# EAGLE schematic Analog-System (EAGLE 8.5.2)
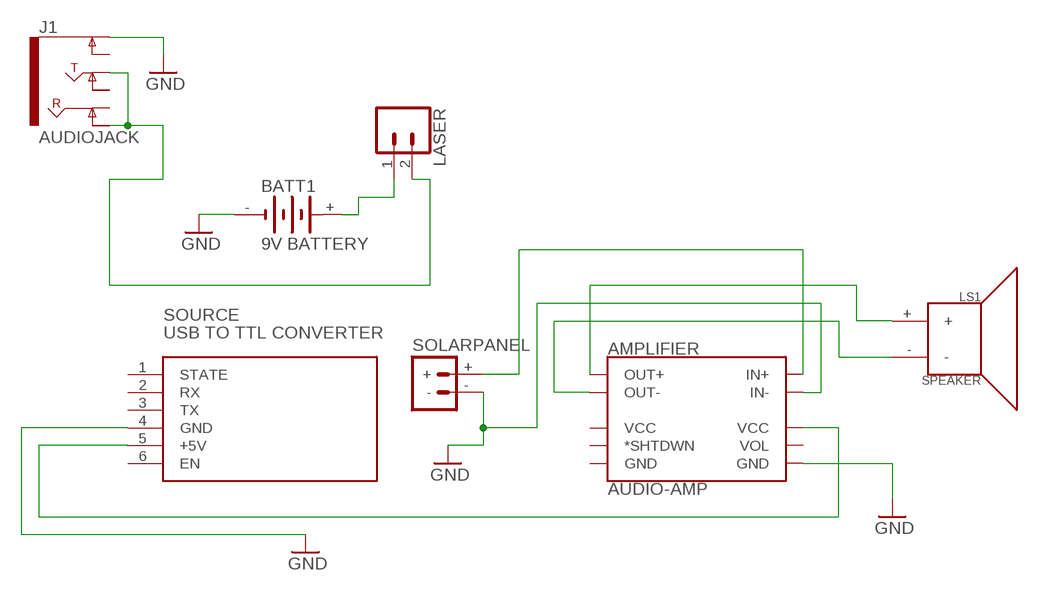
[diagram p0: schematic, sheet 1]

## Parts
AMPLIFIER  AUDIO-AMP  SPARKFUN_AUDIO-AMP-MONODIP  [AUDIO-AMP-MONO]
BATT1  9V BATTERY  2464_BATT_HOLDER  [2464BATT_HOLDER]
J1  AUDIOJACK  AUDIO_JACK_TRS_0.25"_PTH_RA  [AUDIO_JACK_0.25"_TRS_PTH_RA]
LASER  CONN_02  [1X02]
LS1  SPEAKER  [PCB_MOUNT_SPEAKER]
SOLARPANEL  BATTERY_CONN_DEANS  [DEANS]
SOURCE  USB TO TTL CONVERTER  WIRELESS-BLUETOOTH-HC-05  [WIRELESS-BLUETOOTH-HC-05]

## Nets
GND: AMPLIFIER.IN- AMPLIFIER.VOL-(GND) BATT1.- J1.SLEEVE(EARTH) SOLARPANEL.- SOURCE.4(GND)
N$1: AMPLIFIER.VOL+(VCC) SOURCE.5(+5V)
N$2: BATT1.+ LASER.1
N$3: AMPLIFIER.OUT- LS1.-
N$5: AMPLIFIER.OUT+ LS1.+
N$6: AMPLIFIER.IN+ SOLARPANEL.+
N$9: J1.RING-NORM J1.TIP LASER.2
Unconnected: AMPLIFIER.PWR+(VCC) AMPLIFIER.PWR-(GND) AMPLIFIER.S(*SHTDWN) AMPLIFIER.VOL J1.RING J1.SLEEVE-NORM(EARTH-NORM) J1.TIP-NORM SOURCE.1(STATE) SOURCE.2(RX) SOURCE.3(TX) SOURCE.6(EN)

## Library data of the parts
AMPLIFIER = SparkFun-Boards:SPARKFUN_AUDIO-AMP-MONO: SparkFun Mono Audio Amp Breakout- TPA2005D1 This tiny audio amplifier is based on the Texas Instruments TPA2005D1. Its efficient class-D operation means low heat and long battery life. It can drive an 8-Ohm speaker at up to 1.4 Watts SparkFun Products: Mono Audio Amp Breakout <https://www.sparkfun.com/products/11044>
BATT1 = DC_LOAD_AU:2464_BATT_HOLDER: Keystone Electronics Battery Holder 2464
J1 = SparkFun-Connectors:AUDIO_JACK_TRS_0.25"_PTH_RA: Audio Jack, 1/4" TRS jack, horizontal, PTH, aka "Phono jack" Find the connector here: Audio Jack - 1/4" Stereo (right angle) <https://www.sparkfun.com/products/11144> (COM-11144) Datasheet <http://cdn.sparkfun.com/datasheets/Components/General/JP-611%20DD.jpg> Note, although the datasheet and physical part are slightly different, this footprint was proven to mate well on the Proto Pedal. This device is used on these SparkFun Products: SparkFun TRS Jack Breakout - 1/4" Stereo <https://www.sparkfun.com/products/13005> (BOB-13005 ) SparkFun Proto Pedal - sorry bad link - product comming soon! <https://www.sparkfun.com/products/13124> (PRT-13124); PROD_ID: CONN-12339; SF_ID: COM-11144
LASER = SparkFun-Connectors:CONN_02: Multi connection point. Often used as Generic Header-pin footprint for 0.1 inch spaced/style header connections On any of the 0.1 inch spaced packages, you can populate with these: Break Away Headers - Straight <https://www.sparkfun.com/products/116> (PRT-00116) Break Away Male Headers - Right Angle <https://www.sparkfun.com/products/553> (PRT-00553) Female Headers <https://www.sparkfun.com/products/115> (PRT-00115) Break Away Headers - Machine Pin <https://www.sparkfun.com/products/117> (PRT-00117) Break Away Female Headers - Swiss Machine Pin <https://www.sparkfun.com/products/743> (PRT-00743) For SCREWTERMINALS and SPRING TERMINALS visit here: Screw Terimnals on SparkFun.com <https://www.sparkfun.com/search/results?term=Screw+Terminals> (5mm/3.5mm/2.54mm spacing) This device is also useful as a general connection point to wire up your design to another part of your project. Our various solder wires solder well into these plated through hole pads. Hook-Up Wire - Assortment (Stranded, 22 AWG) <https://www.sparkfun.com/products/11375> (PRT-11375) Hook-Up Wire - Assortment (Solid Core, 22 AWG) <https://www.sparkfun.com/products/11367> (PRT-11367) View the entire wire category on our website here <https://www.sparkfun.com/categories/141> Special notes: Molex polarized connector foot print use with: PRT-08233 with associated crimp pins and housings. 2.54_SCREWTERM for use with PRT-10571. 3.5mm Screw Terminal footprints for PRT-08084 5mm Screw Terminal footprints for use with PRT-08432
LS1 = SparkFun-Electromechanical:SPEAKER: Speaker Generic 2-terminal loudspeakers SparkFun Products Speaker - PCB Mount <https://www.sparkfun.com/products/11089> (COM-11089); PROD_ID: COMP-11789; SF_SKU: COM-11089
SOLARPANEL = SparkFun-Connectors:BATTERY_CONN: Battery Connectors Various footprints for battery connections SparkFun Products: Deans Connector -M/F Pair <https://www.sparkfun.com/products/11864>; SF_ID: PRT-11864
SOURCE = diy-modules:WIRELESS-BLUETOOTH-HC-05: Bluetooth Transceiver Module based on HC-05 board Tutorial is available here: https://arduino-info.wikispaces.com/BlueTooth-HC05-HC06-Modules-How-To Click here to find device on ebay.com <http://www.ebay.com/sch/hc-05+module+rs232>